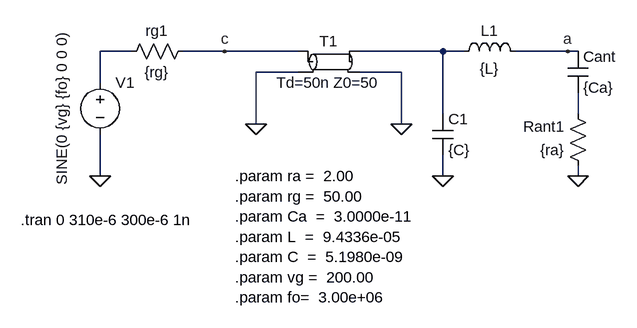
[diagram p0: schematic Entrega_clase_1_b.asc]
Entrega_clase_1_b.asc, the LTspice schematic file:
Version 4
SHEET 1 880 680
WIRE -240 -80 -288 -80
WIRE -96 -80 -160 -80
WIRE 16 -80 -96 -80
WIRE 240 -80 112 -80
WIRE 272 -80 240 -80
WIRE 432 -80 352 -80
WIRE 448 -80 432 -80
WIRE 16 -48 -48 -48
WIRE 176 -48 112 -48
WIRE -288 -32 -288 -80
WIRE 240 16 240 -80
WIRE 448 16 448 -16
WIRE -48 32 -48 -48
WIRE 176 32 176 -48
WIRE -288 112 -288 48
WIRE 240 112 240 80
WIRE 448 112 448 96
FLAG -288 112 0
FLAG 240 112 0
FLAG 448 112 0
FLAG 176 32 0
FLAG -48 32 0
FLAG -96 -80 c
FLAG 432 -80 a
SYMBOL voltage -288 -48 R0
WINDOW 3 -59 174 VLeft 2
WINDOW 123 0 0 Left 0
WINDOW 39 0 0 Left 0
SYMATTR InstName V1
SYMATTR Value SINE(0 {vg} {fo} 0 0 0)
SYMBOL res -256 -64 R270
WINDOW 0 32 56 VTop 2
WINDOW 3 0 56 VBottom 2
SYMATTR InstName rg1
SYMATTR Value {rg}
SYMBOL res 464 112 R180
WINDOW 0 36 76 Left 2
WINDOW 3 36 40 Left 2
SYMATTR InstName Rant1
SYMATTR Value {ra}
SYMBOL cap 224 16 R0
SYMATTR InstName C1
SYMATTR Value {C}
SYMBOL ind 256 -64 R270
WINDOW 0 32 56 VTop 2
WINDOW 3 5 56 VBottom 2
SYMATTR InstName L1
SYMATTR Value {L}
SYMBOL tline 64 -64 R0
SYMATTR InstName T1
SYMBOL cap 432 -80 R0
SYMATTR InstName Cant
SYMATTR Value {Ca}
TEXT -410 180 Left 2 !.tran 0 310e-6 300e-6 1n
TEXT -80 112 Left 2 !.param ra =  2.00 \n.param rg =  50.00 \n.param Ca  =  3.0000e-11 \n.param L  =  9.4336e-05 \n.param C  =  5.1980e-09 \n.param vg =  200.00 \n.param fo=  3.00e+06

The netlist it stands for:
* Entrega_clase_1_b.asc
V1 N001 0 SINE(0 {vg} {fo} 0 0 0)
rg1 N001 c {rg}
Rant1 0 N003 {ra}
C1 N002 0 {C}
L1 N002 a {L}
T1 c 0 N002 0 Td=50n Z0=50
Cant a N003 {Ca}
.tran 0 310e-6 300e-6 1n
.param ra =  2.00
.param rg =  50.00
.param Ca  =  3.0000e-11
.param L  =  9.4336e-05
.param C  =  5.1980e-09
.param vg =  200.00
.param fo=  3.00e+06
.backanno
.end